# Altium project lipo-charger-booster.PrjPcb
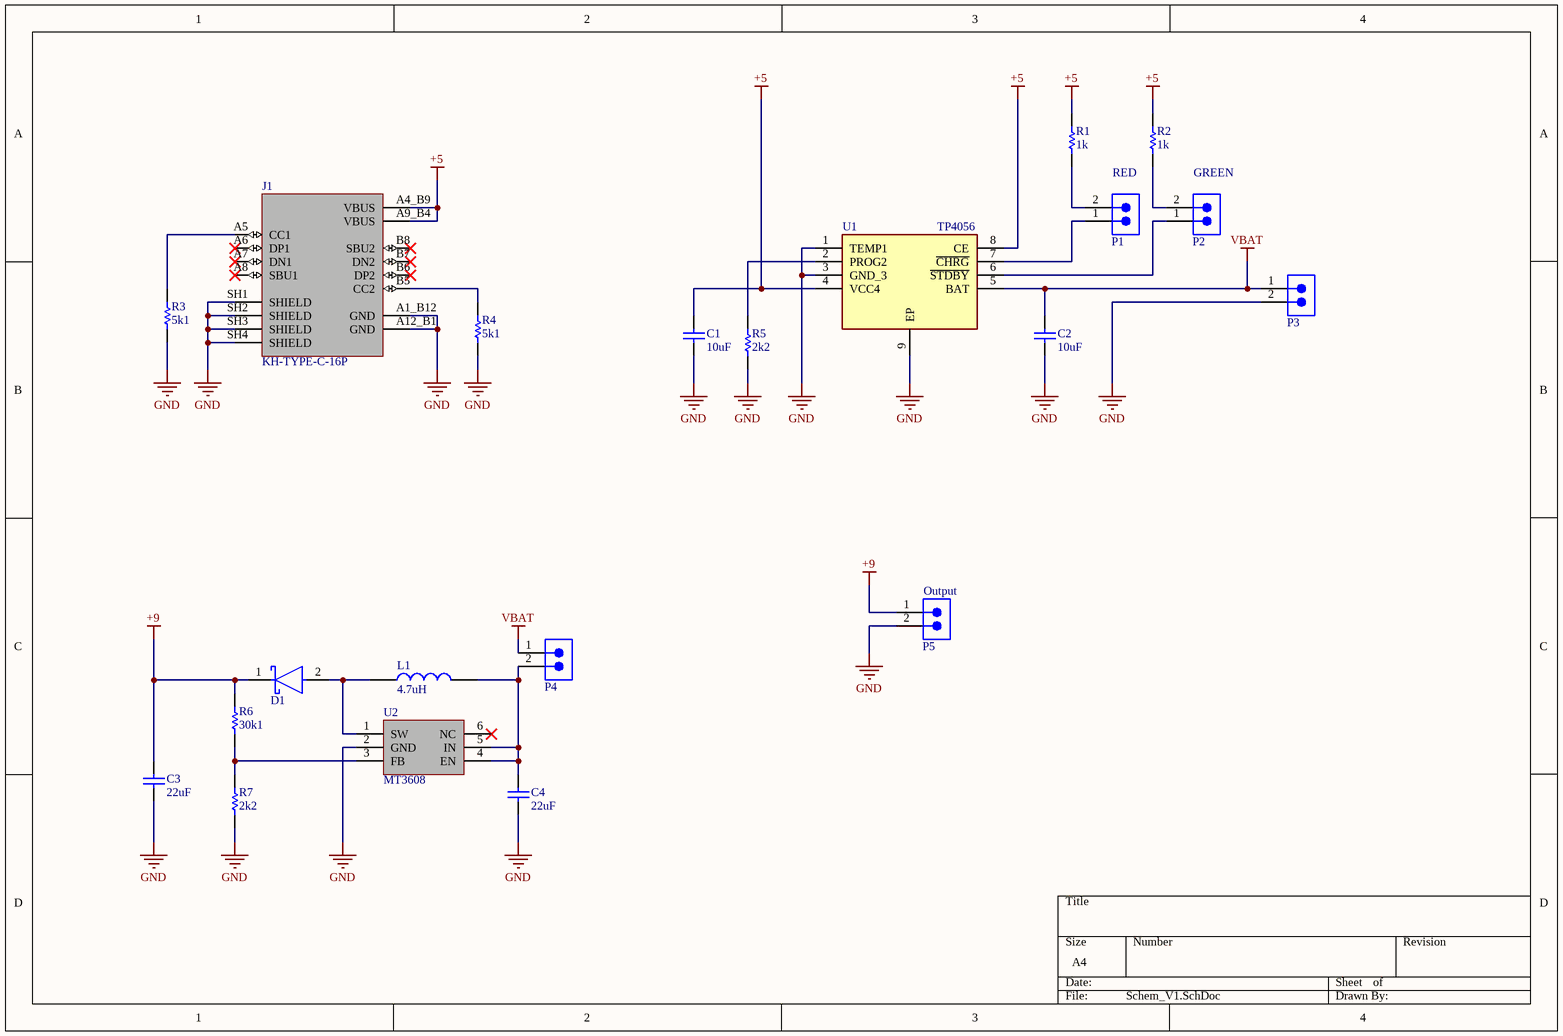
[diagram p0: Schem_V1.SchDoc]
1 sheet, 21 parts. Net scope: global (net labels, ports and power ports of the same name join across sheets).
Board file: PCB_V1.PcbDoc

## Sheet Schem_V1.SchDoc
size A4; SheetNumber: 1; SheetTotal: 1

### Parts
C1  value 10uF  [Wurth 0603 capacitor]  (hidden comment: Generic Capacitor 10uF 0603)
C2  value 10uF  [Wurth 0603 capacitor]  (hidden comment: Generic Capacitor 10uF 0603)
C3  value 22uF  [Wurth 0805 capacitor]  (hidden comment: Generic Capacitor 22uF 0805)
C4  value 22uF  [Wurth 0805 capacitor]  (hidden comment: Generic Capacitor 22uF 0805)
D1  V1FM10-M3/H  [FP-V1FM10-M3-H-MFG]  (value not drawn)
J1  KH-TYPE-C-16P  [KINGHELM_KH-TYPE-C-16P]
L1  value 4.7uH  [cjiang FTC252010S4R7MBCA]  (hidden comment: FTC252010S4R7MBCA)
P1  61300211121  [2x1 2.54mm M]  (value not drawn)
P2  61300211121  [2x1 2.54mm M]  (value not drawn)
P3  61300211121  [2x1 2.54mm M]  (value not drawn)
P4  61300211121  [2x1 2.54mm M]  (value not drawn)
P5  61300211121  [2x1 2.54mm F]  (value not drawn)
R1  value 1k  [Wurth 0603 Resistor]  (hidden comment: Generic Resistor 1k 0603)
R2  value 1k  [Wurth 0603 Resistor]  (hidden comment: Generic Resistor 1k 0603)
R3  value 5k1  [0805 Resistor]  (hidden comment: Generic Resistor 5k1 0805)
R4  value 5k1  [0805 Resistor]  (hidden comment: Generic Resistor 5k1 0805)
R5  value 2k2  [Wurth 0603 Resistor]  (hidden comment: Generic Resistor 2k2 0603)
R6  value 30k1  [Wurth 0603 Resistor]  (hidden comment: Generic Resistor 30k1 0603)
R7  value 2k2  [Wurth 0603 Resistor]  (hidden comment: Generic Resistor 2k2 0603)
U1  TP4056  [SOIC127P600X175-9N]
U2  MT3608  [Aerosemi SOT23-6]

### Nets
+5: C1.2 J1.A4_B9(VBUS) J1.A9_B4(VBUS) R1.2 R2.2 U1.4(VCC4) U1.8(CE)
+9: C3.2 D1.1(C) P5.1 R6.2
GND: C1.1 C2.1 C3.1 C4.1 J1.A1_B12(GND) J1.A12_B1(GND) J1.SH1(SHIELD) J1.SH2(SHIELD) J1.SH3(SHIELD) J1.SH4(SHIELD) P3.2 P5.2 R3.1 R4.1 R5.1 R7.1 U1.1(TEMP1) U1.3(GND_3) U1.9(EP) U2.2(GND)
VBAT: C2.2 P3.1 P4.1 U1.5(BAT)
NetC4_2: C4.2 L1.2 P4.2 U2.4(EN) U2.5(IN)
NetD1_2: D1.2(A) L1.1 U2.1(SW)
NetJ1_A5: J1.A5(CC1) R3.2
NetJ1_B5: J1.B5(CC2) R4.2
NetP1_1: P1.1 U1.7(~{CHRG})
NetP1_2: P1.2 R1.1
NetP2_1: P2.1 U1.6(~{STDBY})
NetP2_2: P2.2 R2.1
NetR5_2: R5.2 U1.2(PROG2)
NetR6_1: R6.1 R7.2 U2.3(FB)

Not connected (* = marked no-connect by the designer): J1 A6(DP1)* A7(DN1)* A8(SBU1)* B6(DP2)* B7(DN2)* B8(SBU2)*; U2 6(NC)*

### Notes on the sheet
- RED
- GREEN
- (near P5) Output

### Library data of the parts
D1 = CMP-02539-000045-1: 1A 100V SMF TRENCH SKY RECT; RoHS Compliant: Yes
J1 = Kinghelm KH-TYPE-C-16P: Value: *; SnapEDA_Link: https://www.snapeda.com/parts/KH-TYPE-C-16P/Ki/view-part/?ref=snap; MP: KH-TYPE-C-16P; Check_prices: https://www.snapeda.com/parts/KH-TYPE-C-16P/Ki/view-part/?ref=eda; Availability: Not in stock; Price: None; Package: None; MF: kinghelm
L1 = 2010 4.7µH  2A: cjiang FTC252010S4R7MBCA
P1-P5 = 2P: WR-PHD Pin Header, THT, Vertical, pitch 2.54mm, 1 Row, 2P; Manufacturer: Wurth Elektronik; Contact Resistance: 20mOhm; Rated Current: 3A; Working Voltage: 250V; Withstanding Voltage: 500V; Manufacturer Part Number: 61300211121; Category: Board-to-Board Connectors; Match Code: WR-PHD; ComponentLink1Description: Website Link; ComponentLink1URL: https://www.we-online.com/redexpert/article/61300211121?ad; ComponentLink2Description: Datasheet Link; ComponentLink2URL: https://www.we-online.com/redexpert/spec/61300211121?ad; Mount: Through Hole; Operating Temperature Max: 105°C; Operating Temperature Min: -40°C; Packaging: Bag; Gender: Pin Header; Number of Pins: 2; Number of Rows: 1; Orientation: Vertical; Pitch: 2.54mm
U1 = TP4056: Lipo charger; Manufacturer_Name: NanJing Top Power; Datasheet Link: https://dlnmh9ip6v2uc.cloudfront.net/datasheets/Prototyping/TP4056.pdf; Height: 1.75mm; Manufacturer_Part_Number: TP4056
U2 = Aerosemi MT3608: Integrated Circuit; Datasheet Link: https://www.olimex.com/Products/Breadboarding/BB-PWR-3608/resources/MT3608.pdf; Height: 1.45mm; Manufacturer_Name: Aerosemi; Manufacturer_Part_Number: MT3608